# Altium schematic sheet shiftLights.SchDoc
size A4
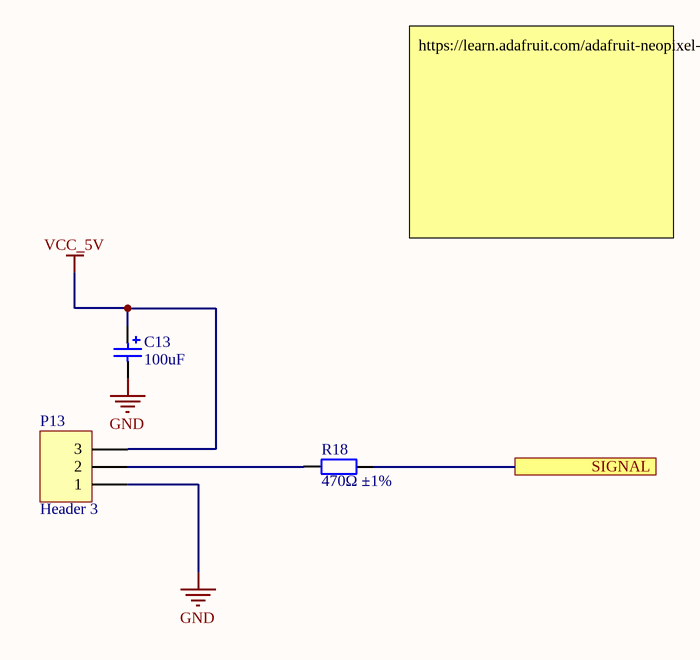
[diagram p0: shiftLights.SchDoc]

## Parts
C13  100uF  [CASE-B_3528]
P13  Header 3  [HDR1X3]
R18  470Ω ±1%  [0603_R]

## Ports
SIGNAL

## Nets
GND: C13.2 P13.1
VCC_5V: C13.1 P13.3
SIGNAL: R18.2 ; port SIGNAL
NetP13_2: P13.2 R18.1

## Notes on the sheet
- https://learn.adafruit.com/adafruit-neopixel-uberguide?view=all

## Library data of the parts
C13 = 3528 100uF (107) 10% 6.3V: Tantalum capacitor; Manufacturer: AVX; PartNumber: TAJB107K006RNJ; Tolerance: 10%; Voltage: 6.3V; ComponentLink1Description: Supplier link; ComponentLink1URL: http://www.szlcsc.com/product/details_16815.html; Package: 3528; Supplier: LC; SuppliersPartNumber: C16133; Capacitance: 100uF
P13 = Header 3: Header, 3-Pin; LatestRevisionDate: 17-Jul-2002; LatestRevisionNote: Re-released for DXP Platform.; Publisher: Altium Limited
R18 = 0603 470R (4700) 1%: Chip resistor; Manufacturer: Uniroyal Elec; PartNumber: 0603WAF4700T5E; Power: 1/10W; ComponentLink1Description: Supplier link; ComponentLink1URL: http://www.szlcsc.com/product/details_23906.html; Package: 0603; Supplier: LC; SuppliersPartNumber: C23179; Resistance: 470Ω; Tolerance: 1%